# Altium schematic sheet cpu1_gsm_module.SchDoc
size A3; DocumentNumber: 5; Revision: V1.0; SheetNumber: 5; SheetTotal: 9; Rule: PcbType=ProtelPcb
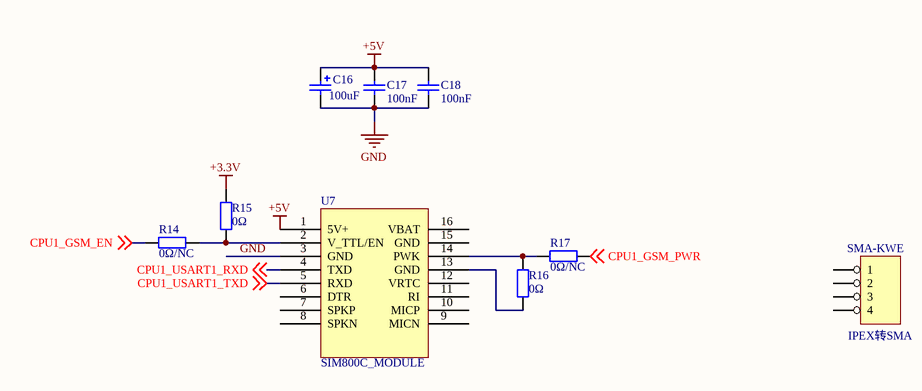
[diagram p0: cpu1_gsm_module.SchDoc]

## Parts
C16  100uF  [CASE-B_3528]
C17  100nF  [0805_C]
C18  100nF  [0805_C]
R14  0Ω/NC  [0805_R]
R15  0Ω  [0805_R]
R16  0Ω  [0805_R]
R17  0Ω/NC  [0805_R]
SMA-KWE  4 HEADER  [SMA-KWE]  (value not drawn)
U7  SIM800C_MODULE  [SIM800C_MODULE]

## Nets
+3.3V: R15.2
+5V: C16.1 C17.2 C18.2 U7.1(5V+)
GND: C16.2 C17.1 C18.1 U7.3(GND)
CPU1_GSM_EN: R14.2 ; off-sheet CPU1_GSM_EN
CPU1_GSM_PWR: R17.1 ; off-sheet CPU1_GSM_PWR
CPU1_USART1_RXD: U7.4(TXD) ; off-sheet CPU1_USART1_RXD
CPU1_USART1_TXD: U7.5(RXD) ; off-sheet CPU1_USART1_TXD
NetR14_1: R14.1 R15.1 U7.2(V_TTL/EN)
NetR16_1: R16.1 R17.2 U7.14(PWK)
NetR16_2: R16.2 U7.13(GND)

Not connected (* = marked no-connect by the designer): SMA-KWE 1 2 3 4; U7 6(DTR) 7(SPKP) 8(SPKN) 9(MICN) 10(MICP) 11(RI) 12(VRTC) 15(GND) 16(VBAT)

## Notes on the sheet
- (near SMA-KWE) IPEX转SMA
- :

## Library data of the parts
C16 = 3528 100uF (107) 10% 6.3V: 钽电容; ComponentLink1Description: 供应商链接; ComponentLink1URL: http://www.szlcsc.com/product/details_16815.html; Package: 3528; Supplier: LC; SuppliersPartNumber: C16133
C17 C18 = 0805 100nF(104) 10% 50V: 贴片电容; ComponentLink1Description: 供应商链接; ComponentLink1URL: http://www.szlcsc.com/product/details_50686.html; Package: 0805; Supplier: LC; SuppliersPartNumber: C49678
R14-R17 = 0805 11KΩ (1102) 1%: 贴片电阻; ComponentLink1Description: 供应商链接; ComponentLink1URL: http://www.szlcsc.com/product/details_18117.html; Package: 0805; Supplier: LC; SuppliersPartNumber: C17429
SMA-KWE = 4 HEADER: 4 Pin Header